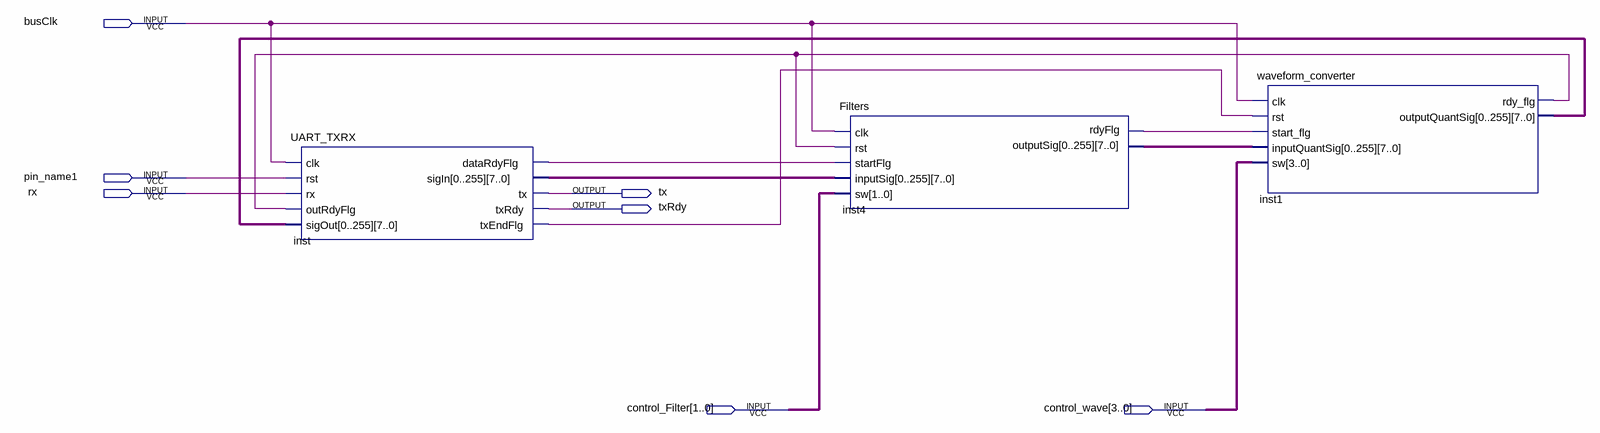
[diagram p0: schematic sheet]
// Quartus schematic Project_4063_Digital_Filter.bdf as structural Verilog: 3 symbols, 7 pins
module Project_4063_Digital_Filter (
  input  busClk,
  input  pin_name1,
  input  rx,
  input  [1:0] control_Filter,
  input  [3:0] control_wave,
  output tx,
  output txRdy
);

  wire inst1_rdy_flg, inst4_rdyflg, inst_datardyflg, inst_txendflg;
  wire [2047:0] inst1_outputquantsig, inst4_outputsig, inst_sigin;

  UART_TXRX inst (
    .clk(busClk), .rst(pin_name1), .rx(rx), .outRdyFlg(inst1_rdy_flg), .sigOut(inst1_outputquantsig),
    .sigIn(inst_sigin), .dataRdyFlg(inst_datardyflg), .tx(tx), .txRdy(txRdy), .txEndFlg(inst_txendflg));
  Filters inst4 (
    .clk(busClk), .rst(inst1_rdy_flg), .startFlg(inst_datardyflg), .inputSig(inst_sigin),
    .sw(control_Filter), .outputSig(inst4_outputsig), .rdyFlg(inst4_rdyflg));
  waveform_converter inst1 (
    .clk(busClk), .rst(inst_txendflg), .start_flg(inst4_rdyflg), .sw(control_wave),
    .inputQuantSig(inst4_outputsig), .rdy_flg(inst1_rdy_flg), .outputQuantSig(inst1_outputquantsig));
endmodule
